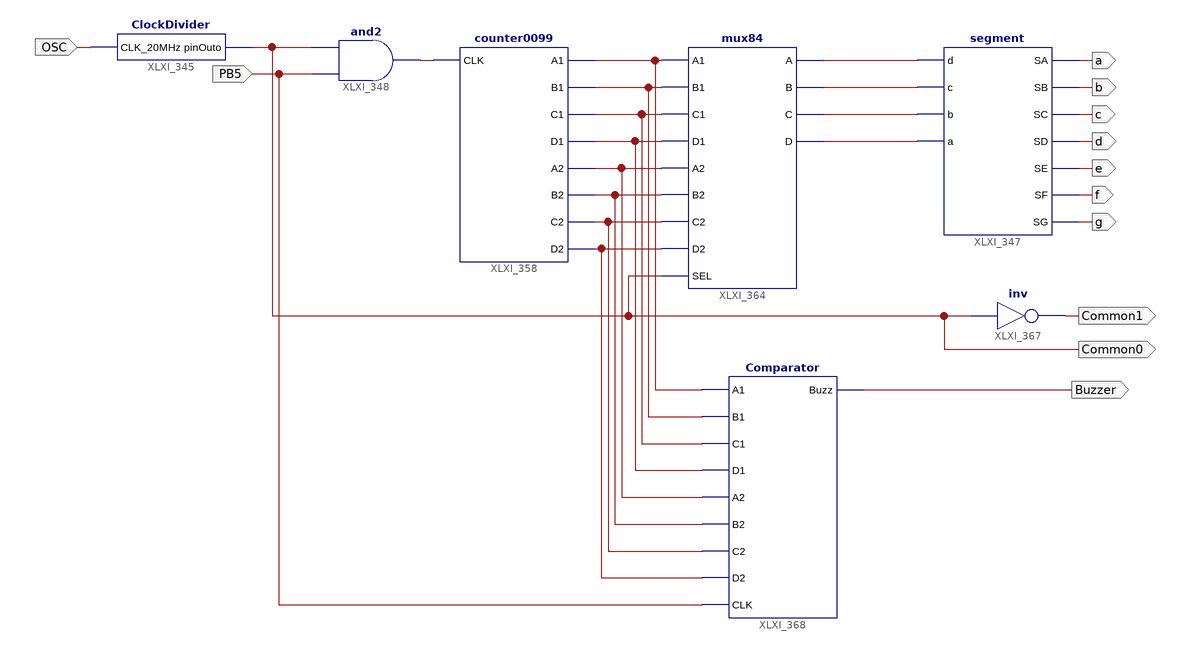
[diagram p0: schematic sheet 1]
// Xilinx ISE schematic lab06sch.sch (spartan6) as structural Verilog: 7 symbols, 12 ports
module lab06sch (
  input  PB5,
  input  OSC,
  output a,
  output b,
  output c,
  output d,
  output e,
  output f,
  output g,
  output Buzzer,
  output Common0,
  output Common1
);

  wire XLXN_72, XLXN_73, XLXN_74, XLXN_75, XLXN_103, XLXN_104, XLXN_105, XLXN_106, XLXN_107, XLXN_108,
       XLXN_109, XLXN_111, XLXN_117;

  counter0099 XLXI_358 (
    .A1(XLXN_103), .A2(XLXN_107), .B1(XLXN_104), .B2(XLXN_108), .C1(XLXN_105), .C2(XLXN_109), .CLK(XLXN_117),
    .D1(XLXN_106), .D2(XLXN_111));
  and XLXI_348 (XLXN_117, PB5, Common0);
  mux84 XLXI_364 (
    .A(XLXN_72), .A1(XLXN_103), .A2(XLXN_107), .B(XLXN_73), .B1(XLXN_104), .B2(XLXN_108), .C(XLXN_74),
    .C1(XLXN_105), .C2(XLXN_109), .D(XLXN_75), .D1(XLXN_106), .D2(XLXN_111), .SEL(Common0));
  segment XLXI_347 (
    .a(XLXN_75), .b(XLXN_74), .c(XLXN_73), .d(XLXN_72), .SA(a), .SB(b), .SC(c), .SD(d), .SE(e), .SF(f), .SG(g));
  not XLXI_367 (Common1, Common0);
  Comparator XLXI_368 (
    .A1(XLXN_103), .B1(XLXN_104), .C1(XLXN_105), .D1(XLXN_106), .A2(XLXN_107), .B2(XLXN_108), .C2(XLXN_109),
    .D2(XLXN_111), .CLK(PB5), .Buzz(Buzzer));
  ClockDivider XLXI_345 (.CLK_20MHz(OSC), .pinOuto(Common0));
endmodule
